# Altium schematic sheet [02] - BLOCK DIAGRAM.SchDoc
size Letter; Author: Paola Andrea Ayala Pineda; Organization: Altium Limited; Address1: L3, 12a Rodborough Rd; Address2: Frenchs Forest; Address3: NSW; Address4: Australia 2086; Revision: 1.0; SheetNumber: 1; SheetTotal: 5; Carnet: 19091
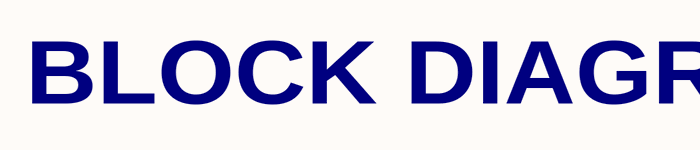
[diagram p0: [02] - BLOCK DIAGRAM.SchDoc]

## Notes on the sheet
- BLOCK DIAGRAM
- Proyecto:
- Documento:
- Autor:
- Carnet:
- Fecha:
- Revision:
- Tamaño:
- Carta
- Hoja:
- de